# Altium schematic sheet Principal.SchDoc: Levitador magnético
size A4; Date: 27/10/2020; DocumentNumber: 1; SheetNumber: 1; SheetTotal: 7
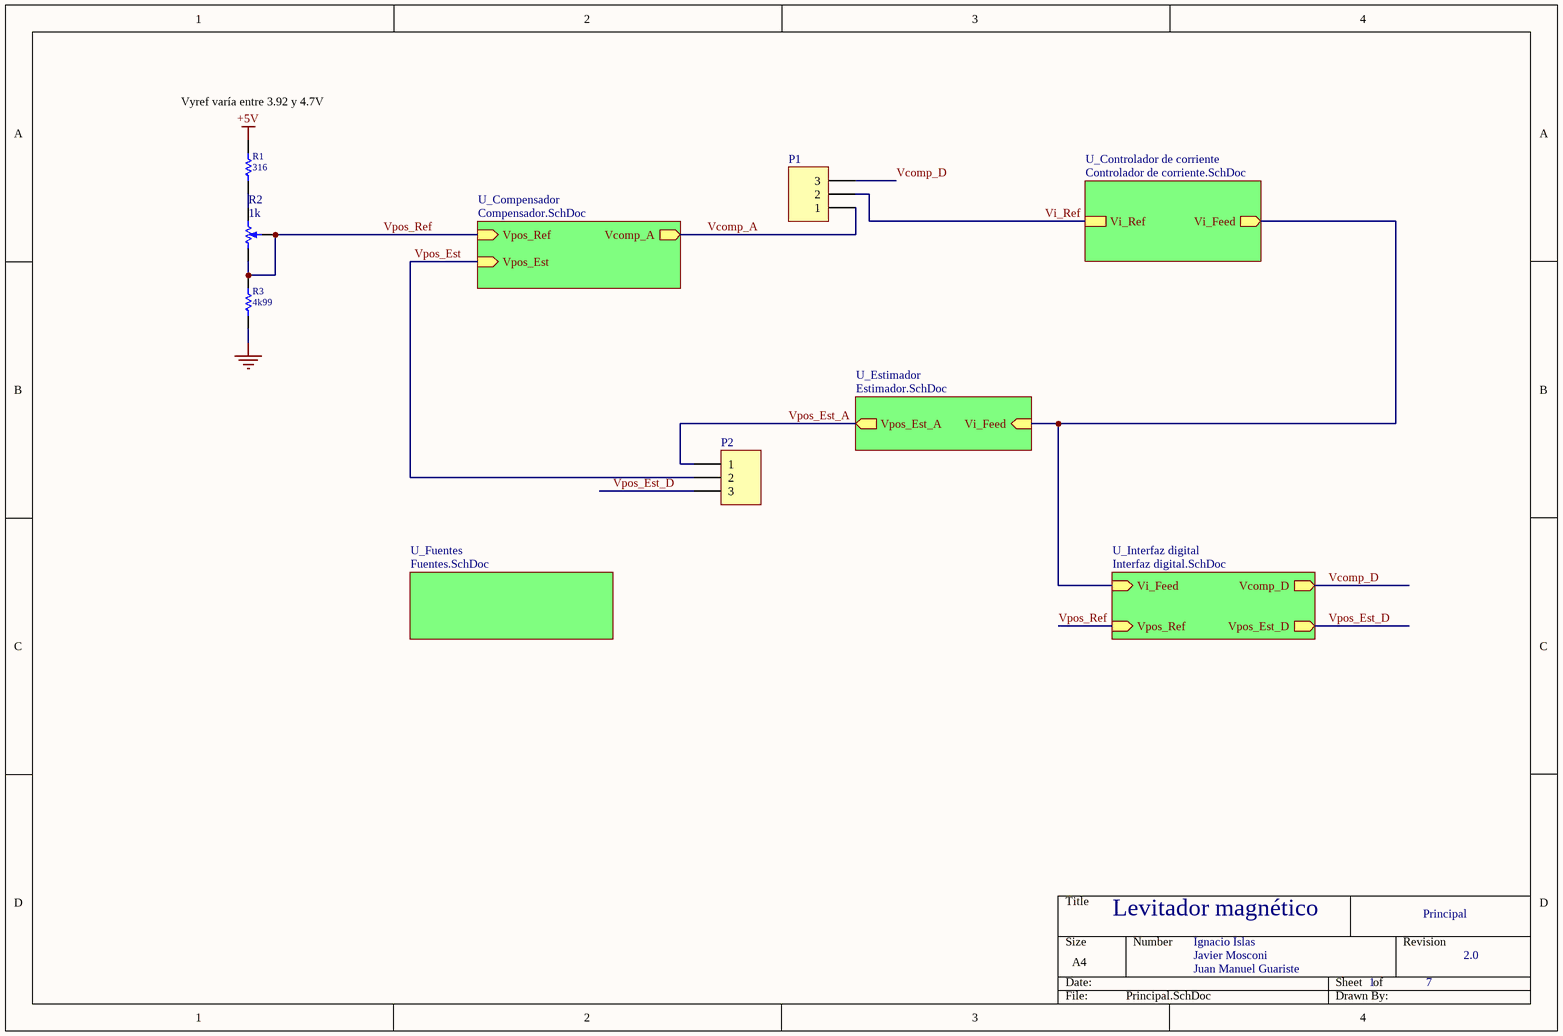
[diagram p0: Principal.SchDoc]

## Parts
P1  Header 3  [HDR1X3]  (value not drawn)
P2  Header 3  [HDR1X3]  (value not drawn)
R1  316  [R1206]
R2  value 1k  [pote_5_pines_vertical]  (hidden comment: Potenciometro)
R3  4k99  [R1206]

## Sub-sheets
U_Compensador = Compensador.SchDoc: Vcomp_A (out), Vpos_Est (in), Vpos_Ref (in)
U_Controlador de corriente = Controlador de corriente.SchDoc: Vi_Ref, Vi_Feed (out)
U_Estimador = Estimador.SchDoc: Vi_Feed (in), Vpos_Est_A (out)
U_Fuentes = Fuentes.SchDoc: no entries
U_Interfaz digital = Interfaz digital.SchDoc: Vi_Feed (in), Vpos_Ref (in), Vcomp_D (out), Vpos_Est_D (out)

## Nets
+5V: R1.2
GND: R3.1
Vcomp_A: P1.1 ; sheet U_Compensador/Vcomp_A
Vcomp_D: P1.3 ; sheet U_Interfaz digital/Vcomp_D
Vi_Ref: P1.2 ; sheet U_Controlador de corriente/Vi_Ref
Vpos_Est: P2.2 ; sheet U_Compensador/Vpos_Est
Vpos_Est_A: P2.1 ; sheet U_Estimador/Vpos_Est_A
Vpos_Est_D: P2.3 ; sheet U_Interfaz digital/Vpos_Est_D
Vpos_Ref: R2.2(W) R2.3(-) R3.2 ; sheet U_Compensador/Vpos_Ref, sheet U_Interfaz digital/Vpos_Ref
NetR1_1: R1.1 R2.1(+)
(unnamed): sheet U_Estimador/Vi_Feed, sheet U_Interfaz digital/Vi_Feed, sheet U_Controlador de corriente/Vi_Feed

## Notes on the sheet
- (near R1) Vyref varía entre 3.92 y 4.7V
- Principal
- Ignacio Islas
- Javier Mosconi
- Juan Manuel Guariste
- 2.0

## Library data of the parts
P1 P2 = Header 3: TERM BLK 3P SIDE ENT 2.54MM PCB; Manufacturer: TE Connectivity AMP Connectors; Mfr PN: 282834-3; Class: Connector; Link: https://www.digikey.com/en/products/detail/te-connectivity-amp-connectors/282834-3/1153264; Supplier 1 PN: A98334-ND; Supplier 1: Digi-Key; Supplier 2: Mouser; Supplier 2 PN: 571-2828343
R1 = R1206: RES 316 OHM 1% 1/4W 1206; Manufacturer: Stackpole Electronics Inc; Mfr PN: RMCF1206FT316R; LatestRevisionDate: 29/7/2021; PackageReference: 1206; PackageDescription: SMT Chip Resistor; Supplier 1: Digi-Key; Value: 316; Tolerance: 1%; Supplier 1 PN: RMCF1206FT316RCT-ND
R2 = Potenciometro: POT 1K OHM 0.08W CARBON LINEAR; Manufacturer: Bourns Inc.; Mfr PN: PDB12-H4251-102BF; Supplier 1: Digi-Key; Supplier 1 PN: PDB12-H4251-102BF-ND
R3 = R1206: RES 4.99K OHM 1% 1/4W 1206; Manufacturer: Stackpole Electronics Inc; Mfr PN: RMCF1206FT4K99; LatestRevisionDate: 29/7/2021; PackageReference: 1206; PackageDescription: SMT Chip Resistor; Supplier 1: Digi-Key; Value: 4k99; Tolerance: 1%; Supplier 1 PN: RMCF1206FT4K99CT-ND